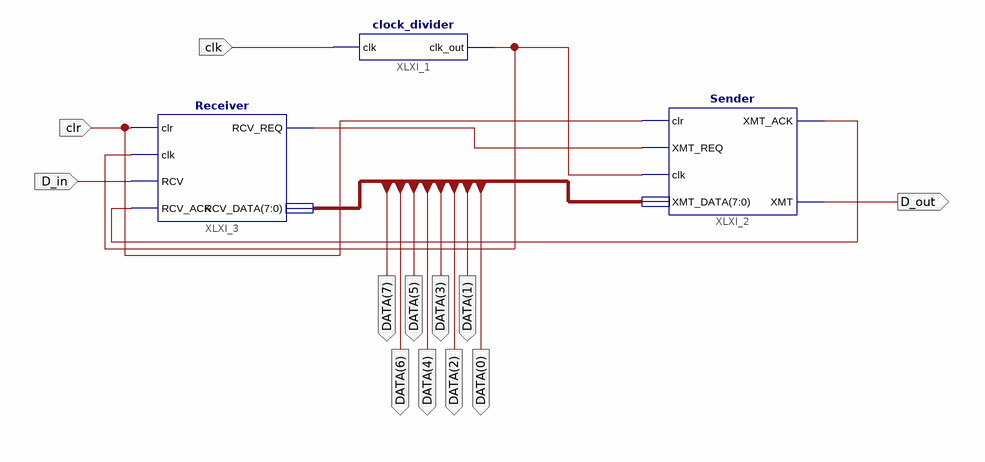
[diagram p0: schematic sheet 1]
// Xilinx ISE schematic uart.sch (spartan6) as structural Verilog: 3 symbols, 12 ports
module uart (
  input  clr,
  input  D_in,
  input  clk,
  output D_out,
  output [7:0] DATA
);

  wire XLXN_3, XLXN_5, XLXN_6;

  clock_divider XLXI_1 (.clk(clk), .clk_out(XLXN_5));
  Sender XLXI_2 (.clr(clr), .XMT_REQ(XLXN_3), .clk(XLXN_5), .XMT_DATA(DATA), .XMT_ACK(XLXN_6), .XMT(D_out));
  Receiver XLXI_3 (.clr(clr), .clk(XLXN_5), .RCV(D_in), .RCV_ACK(XLXN_6), .RCV_REQ(XLXN_3), .RCV_DATA(DATA));
endmodule
